# Altium schematic sheet InputVoltageSensingSketch.SchDoc
size A4; SheetNumber: 5; SheetTotal: 8
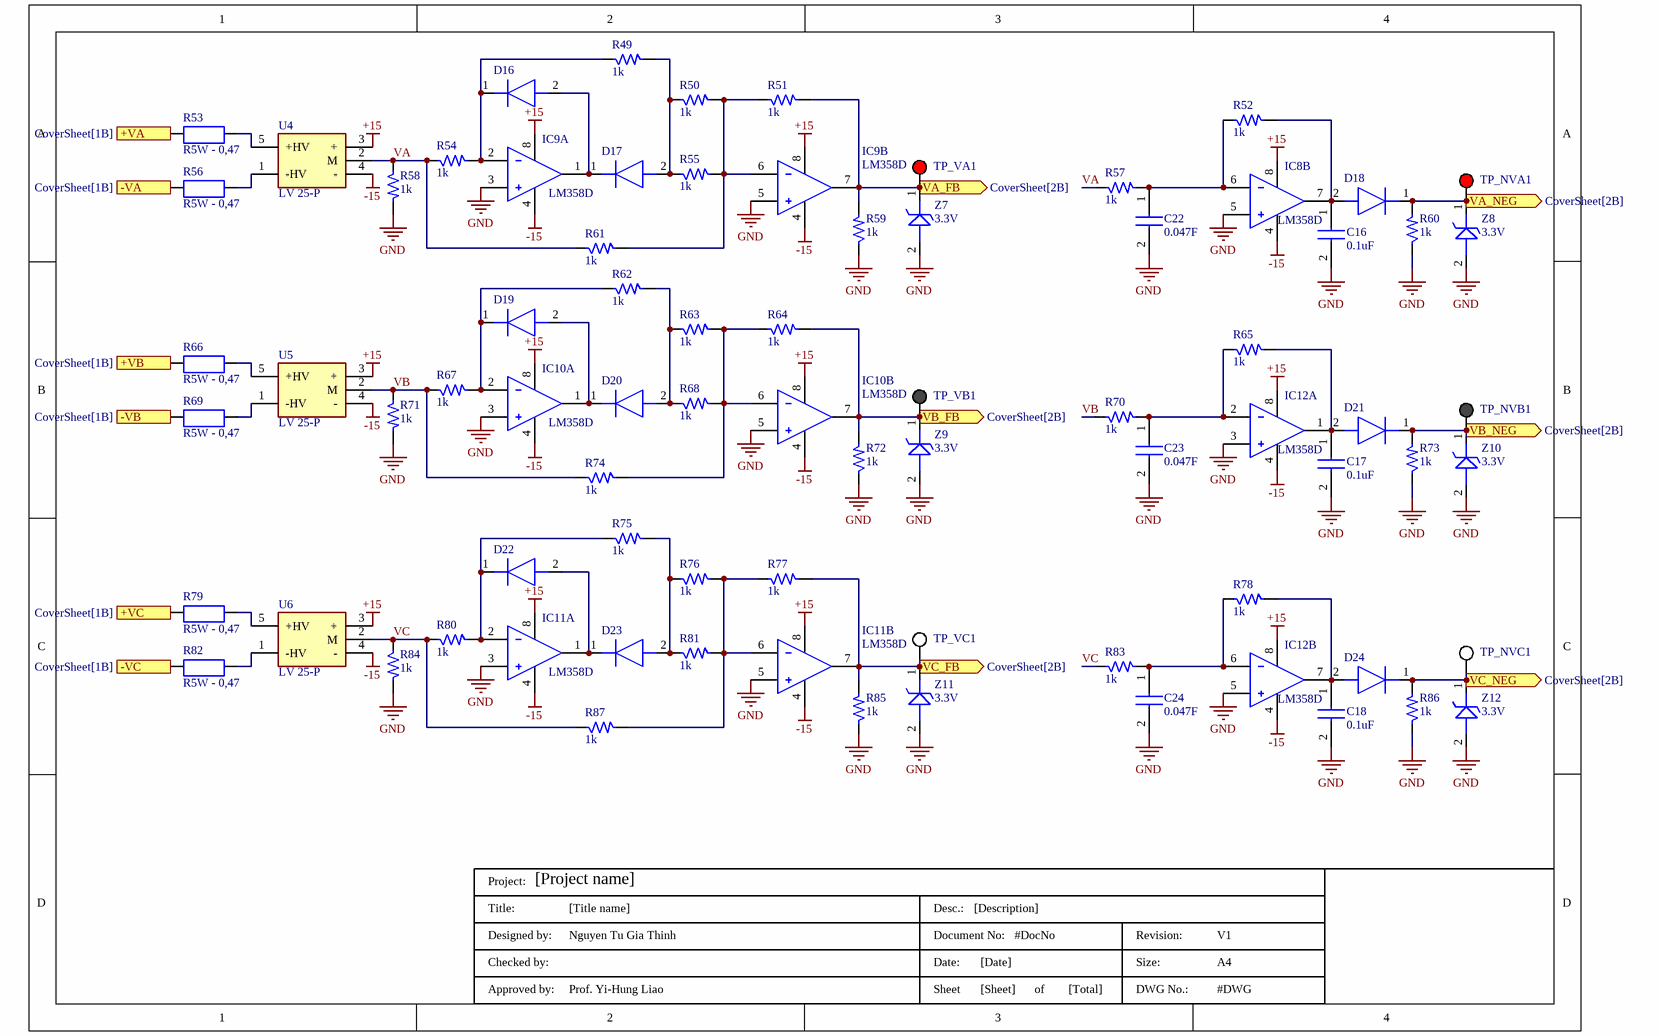
[diagram p0: InputVoltageSensingSketch.SchDoc]

## Parts
C16  0.1uF  [C0805]
C17  0.1uF  [C0805]
C18  0.1uF  [C0805]
C22  value 0.047F  [C0805]  (hidden comment: C0805C473F3GECAUTO7210)
C23  value 0.047F  [C0805]  (hidden comment: C0805C473F3GECAUTO7210)
C24  value 0.047F  [C0805]  (hidden comment: C0805C473F3GECAUTO7210)
D16  MBRM130LT1G  [MBRM130LT1G]  (value not drawn)
D17  MBRM130LT1G  [MBRM130LT1G]  (value not drawn)
D18  MBRM130LT1G  [MBRM130LT1G]  (value not drawn)
D19  MBRM130LT1G  [MBRM130LT1G]  (value not drawn)
D20  MBRM130LT1G  [MBRM130LT1G]  (value not drawn)
D21  MBRM130LT1G  [MBRM130LT1G]  (value not drawn)
D22  MBRM130LT1G  [MBRM130LT1G]  (value not drawn)
D23  MBRM130LT1G  [MBRM130LT1G]  (value not drawn)
D24  MBRM130LT1G  [MBRM130LT1G]  (value not drawn)
IC8  LM358D  [SOIC127P600X175-8N]  (part B of 2)
IC9  LM358D  [SOIC127P600X175-8N]  (parts A,B of 2)
IC10  LM358D  [SOIC127P600X175-8N]  (parts A,B of 2)
IC11  LM358D  [SOIC127P600X175-8N]  (parts A,B of 2)
IC12  LM358D  [SOIC127P600X175-8N]  (parts A,B of 2)
R49  1k  [SM-1206]
R50  1k  [SM-1206]
R51  1k  [SM-1206]
R52  1k  [SM-1206]
R53  R5W - 0,47  [R5WD]
R54  1k  [SM-1206]
R55  1k  [SM-1206]
R56  R5W - 0,47  [R5WD]
R57  1k  [SM-1206]
R58  1k  [SM-1206]
R59  1k  [SM-1206]
R60  1k  [SM-1206]
R61  1k  [SM-1206]
R62  1k  [SM-1206]
R63  1k  [SM-1206]
R64  1k  [SM-1206]
R65  1k  [SM-1206]
R66  R5W - 0,47  [R5WD]
R67  1k  [SM-1206]
R68  1k  [SM-1206]
R69  R5W - 0,47  [R5WD]
R70  1k  [SM-1206]
R71  1k  [SM-1206]
R72  1k  [SM-1206]
R73  1k  [SM-1206]
R74  1k  [SM-1206]
R75  1k  [SM-1206]
R76  1k  [SM-1206]
R77  1k  [SM-1206]
R78  1k  [SM-1206]
R79  R5W - 0,47  [R5WD]
R80  1k  [SM-1206]
R81  1k  [SM-1206]
R82  R5W - 0,47  [R5WD]
R83  1k  [SM-1206]
R84  1k  [SM-1206]
R85  1k  [SM-1206]
R86  1k  [SM-1206]
R87  1k  [SM-1206]
TitleBlock  DWG No.: #DWG  Size:: A4  Revision:: V1  Total of Sheets: [Total]  Sheet: [Sheet]  Date:: [Date]  Document No:: #DocNo  Desc.:: [Description]  Approved by:: Prof. Yi-Hung Liao  Designed by:: Nguyen Tu Gia Thinh  Title:: [Title name]  Project: [Project name]  (hidden comment: TitleBlock)  (graphical)
TP_NVA1  (no value)  [5000]
TP_NVB1  (no value)  [5001]
TP_NVC1  (no value)  [5002]
TP_VA1  (no value)  [5000]
TP_VB1  (no value)  [5001]
TP_VC1  (no value)  [5002]
U4  LV 25-P  [LV-25-P]
U5  LV 25-P  [LV-25-P]
U6  LV 25-P  [LV-25-P]
Z7  3.3V  [DIOM5226X230N]
Z8  3.3V  [DIOM5226X230N]
Z9  3.3V  [DIOM5226X230N]
Z10  3.3V  [DIOM5226X230N]
Z11  3.3V  [DIOM5226X230N]
Z12  3.3V  [DIOM5226X230N]

## Ports
+VA (in, see CoverSheet[1B]), +VB (in, see CoverSheet[1B]), +VC (in, see CoverSheet[1B]), -VA (in, see CoverSheet[1B]), -VB (in, see CoverSheet[1B]), -VC (in, see CoverSheet[1B]), VA_FB (out, see CoverSheet[2B]), VA_NEG (out, see CoverSheet[2B]), VB_FB (out, see CoverSheet[2B]), VB_NEG (out, see CoverSheet[2B]), VC_FB (out, see CoverSheet[2B]), VC_NEG (out, see CoverSheet[2B])

## Nets
+15: IC8.8(V+) IC9.8(V+) IC10.8(V+) IC11.8(V+) IC12.8(V+) U4.3(+) U5.3(+) U6.3(+)
-15: IC8.4(V-) IC9.4(V-) IC10.4(V-) IC11.4(V-) IC12.4(V-) U4.4(-) U5.4(-) U6.4(-)
GND: C16.2 C17.2 C18.2 C22.2 C23.2 C24.2 IC8.5(IN2+) IC9.3(IN1+) IC9.5(IN2+) IC10.3(IN1+) IC10.5(IN2+) IC11.3(IN1+) IC11.5(IN2+) IC12.3(IN1+) IC12.5(IN2+) R58.2 R59.1 R60.1 R71.2 R72.1 R73.1 R84.2 R85.1 R86.1 Z7.2(A) Z8.2(A) Z9.2(A) Z10.2(A) Z11.2(A) Z12.2(A)
+VA: R53.1 ; port +VA
+VB: R66.1 ; port +VB
+VC: R79.1 ; port +VC
-VA: R56.1 ; port -VA
-VB: R69.1 ; port -VB
-VC: R82.1 ; port -VC
VA: R54.1 R57.1 R58.1 R61.1 U4.2(M)
VA_FB: IC9.7(OUT2) R51.2 R59.2 TP_VA1.1 Z7.1(K) ; port VA_FB
VA_NEG: D18.1(K) R60.2 TP_NVA1.1 Z8.1(K) ; port VA_NEG
VB: R67.1 R70.1 R71.1 R74.1 U5.2(M)
VB_FB: IC10.7(OUT2) R64.2 R72.2 TP_VB1.1 Z9.1(K) ; port VB_FB
VB_NEG: D21.1(K) R73.2 TP_NVB1.1 Z10.1(K) ; port VB_NEG
VC: R80.1 R83.1 R84.1 R87.1 U6.2(M)
VC_FB: IC11.7(OUT2) R77.2 R85.2 TP_VC1.1 Z11.1(K) ; port VC_FB
VC_NEG: D24.1(K) R86.2 TP_NVC1.1 Z12.1(K) ; port VC_NEG
NetC16_1: C16.1 D18.2(A) IC8.7(OUT2) R52.2
NetC17_1: C17.1 D21.2(A) IC12.1(OUT1) R65.2
NetC18_1: C18.1 D24.2(A) IC12.7(OUT2) R78.2
NetC22_1: C22.1 IC8.6(IN2-) R52.1 R57.2
NetC23_1: C23.1 IC12.2(IN1-) R65.1 R70.2
NetC24_1: C24.1 IC12.6(IN2-) R78.1 R83.2
NetD16_1: D16.1(K) IC9.2(IN1-) R49.1 R54.2
NetD16_2: D16.2(A) D17.1(K) IC9.1(OUT1)
NetD17_2: D17.2(A) R49.2 R50.1 R55.1
NetD19_1: D19.1(K) IC10.2(IN1-) R62.1 R67.2
NetD19_2: D19.2(A) D20.1(K) IC10.1(OUT1)
NetD20_2: D20.2(A) R62.2 R63.1 R68.1
NetD22_1: D22.1(K) IC11.2(IN1-) R75.1 R80.2
NetD22_2: D22.2(A) D23.1(K) IC11.1(OUT1)
NetD23_2: D23.2(A) R75.2 R76.1 R81.1
NetIC9_6: IC9.6(IN2-) R50.2 R51.1 R55.2 R61.2
NetIC10_6: IC10.6(IN2-) R63.2 R64.1 R68.2 R74.2
NetIC11_6: IC11.6(IN2-) R76.2 R77.1 R81.2 R87.2
NetR53_2: R53.2 U4.5(+HV)
NetR56_2: R56.2 U4.1(-HV)
NetR66_2: R66.2 U5.5(+HV)
NetR69_2: R69.2 U5.1(-HV)
NetR79_2: R79.2 U6.5(+HV)
NetR82_2: R82.2 U6.1(-HV)

## Notes on the sheet
- (in symbol Title Block 2) Project:; Title:; Desc.:; Designed by:; Document No:; Revision:; Checked by:; Date:; Size:; Approved by:; Sheet; of; DWG No.:

## Library data of the parts
C16-C18 = C0805C104K3RACTU: Capacitor; Manufacturer_Name: KEMET; Datasheet Link: https://content.kemet.com/datasheets/KEM_C1002_X7R_SMD.pdf; Height: 1.1mm; Manufacturer_Part_Number: C0805C104K3RACTU; Mouser Part Number: 80-C0805C104K3R; Mouser Price/Stock: https://www.mouser.co.uk/ProductDetail/KEMET/C0805C104K3RACTU?qs=zZwvocWqSRjmUvfNxkIN%2Fg%3D%3D; Arrow Part Number: C0805C104K3RACTU; Arrow Price/Stock: https://www.arrow.com/en/products/c0805c104k3ractu/kemet-corporation; Capacitance: 0.1uF
C22-C24 = C0805C473F3GECAUTO7210: Capacitor; Manufacturer_Name: KEMET; Datasheet Link: https://content.kemet.com/datasheets/KEM_C1091_C0G_ESD.pdf; Height: 1.1mm; Manufacturer_Part_Number: C0805C473F3GECAUTO7210; Mouser Part Number: 80-C0805C473F3GEAULR; Mouser Price/Stock: https://www.mouser.co.uk/ProductDetail/KEMET/C0805C473F3GECAUTO7210?qs=55YtniHzbhCk%252BaMpaMvfmA%3D%3D
D16-D24 = MBRM130LT1G: Diode; Manufacturer_Name: onsemi; Datasheet Link: http://www.onsemi.com/pub/Collateral/MBRM130L-D.PDF; Manufacturer_Part_Number: MBRM130LT1G; Mouser Part Number: 863-MBRM130LT1G; Mouser Price/Stock: https://www.mouser.co.uk/ProductDetail/onsemi/MBRM130LT1G?qs=3JMERSakebrXPEmSbT3BNg%3D%3D; Arrow Part Number: MBRM130LT1G; Arrow Price/Stock: https://www.arrow.com/en/products/mbrm130lt1g/on-semiconductor?region=europe
IC8-IC12 = LM358D: Integrated Circuit; Manufacturer_Name: Texas Instruments; Datasheet Link: http://www.ti.com/lit/ds/symlink/lm358.pdf; Height: 1.75mm; Manufacturer_Part_Number: LM358D; Mouser Part Number: 595-LM358D; Mouser Price/Stock: https://www.mouser.co.uk/ProductDetail/Texas-Instruments/LM358D?qs=X1HXWTtiZ0RJBM%2FvBfVo8g%3D%3D; Arrow Part Number: LM358D; Arrow Price/Stock: https://www.arrow.com/en/products/lm358d/texas-instruments?region=nac
R49-R52 R54 R55 R57-R65 R67 R68 R70-R78 R80 R81 R83-R87 = R: Resistor 1/4W; Value: R1/4W - 1K
R53 R56 R66 R69 R79 R82 = R5W: Resistor 5W; Value: R5W - 0,47R
TitleBlock = Title Block 2
TP_NVA1 TP_VA1 = 5000: Test Point Red, Multipurpose, TH
TP_NVB1 TP_VB1 = 5001: Test Point Black, Multipurpose, TH
TP_NVC1 TP_VC1 = 5002: Test Point White, Multipurpose, TH
U4-U6 = LV 25-P: Voltage Transducer 600V; Manufacturer_Name: LEM; Manufacturer_Part_Number: LV25P
Z7-Z12 = BZG05C3V3-HM3-08: Zener Diode; Manufacturer_Name: Vishay; Datasheet Link: https://www.vishay.com/doc?86135; Height: 2.3mm; Manufacturer_Part_Number: BZG05C3V3-HM3-08; Mouser Part Number: 78-BZG05C3V3-HM3-08; Mouser Price/Stock: https://www.mouser.co.uk/ProductDetail/Vishay-Semiconductors/BZG05C3V3-HM3-08?qs=W0yvOO0ixfFdOsuRX87wbg%3D%3D; Arrow Part Number: BZG05C3V3-HM3-08; Arrow Price/Stock: https://www.arrow.com/en/products/bzg05c3v3-hm3-08/vishay?region=nac